# EAGLE design RCS_Cntrl_Board (EAGLE 8.7.1)
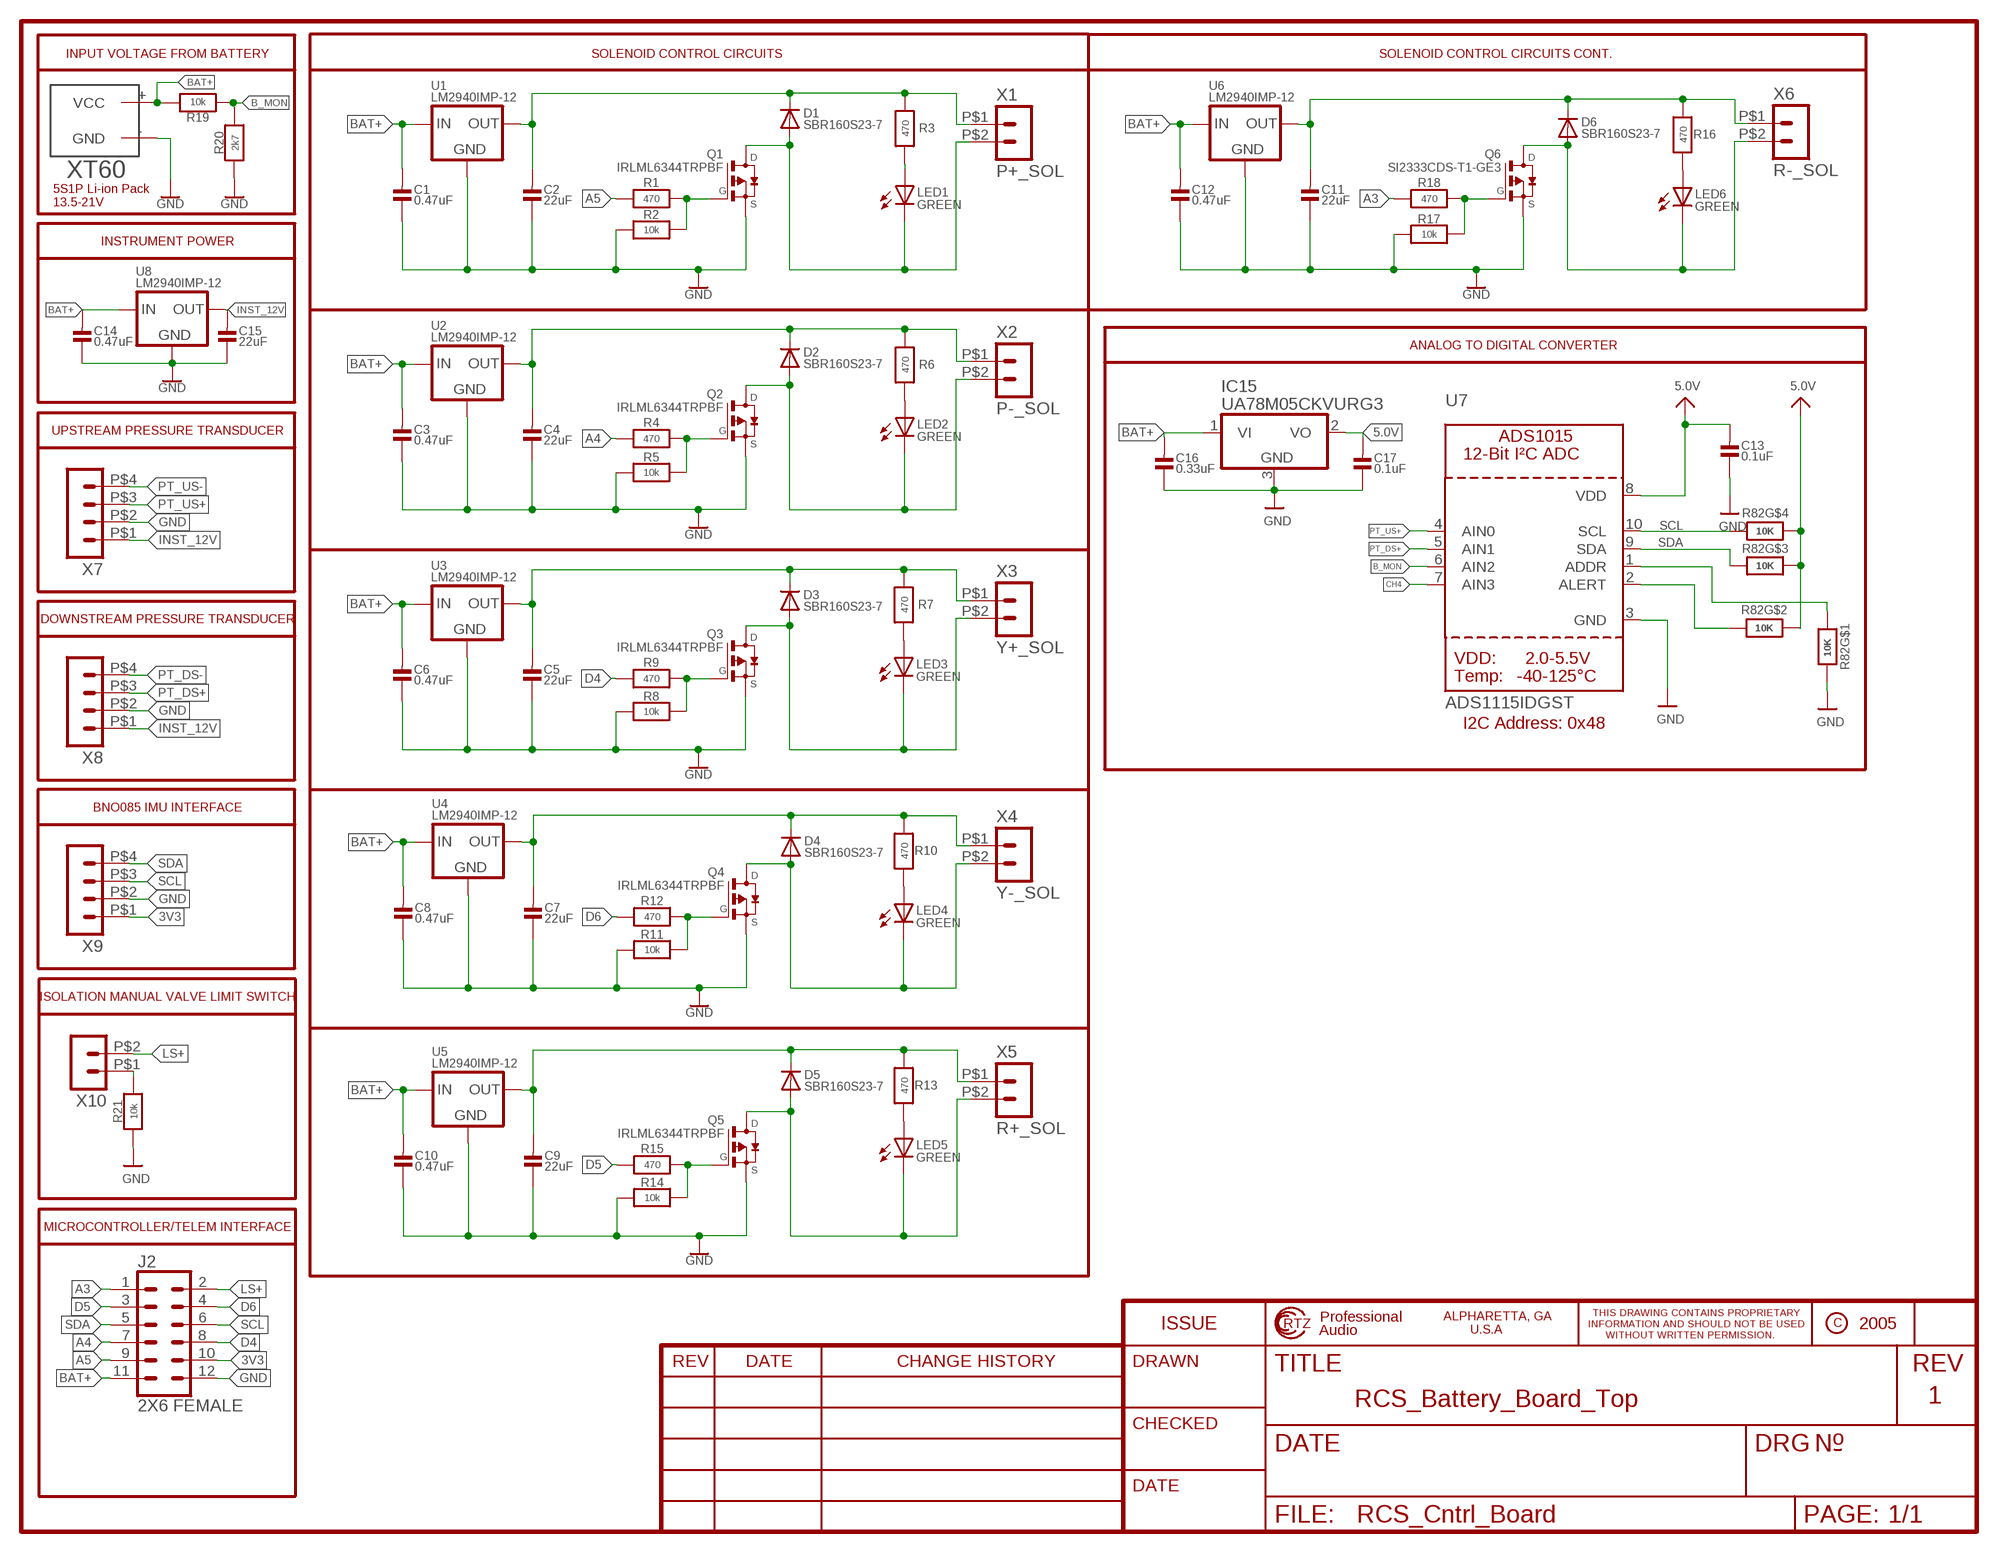
[diagram p0: schematic, sheet 1]

## Parts
C1  0.47uF  CAP_CERAMIC0603  [0603]
C2  22uF  CAP_CERAMIC0603  [0603]
C3  0.47uF  CAP_CERAMIC0603  [0603]
C4  22uF  CAP_CERAMIC0603  [0603]
C5  22uF  CAP_CERAMIC0603  [0603]
C6  0.47uF  CAP_CERAMIC0603  [0603]
C7  22uF  CAP_CERAMIC0603  [0603]
C8  0.47uF  CAP_CERAMIC0603  [0603]
C9  22uF  CAP_CERAMIC0603  [0603]
C10  0.47uF  CAP_CERAMIC0603  [0603]
C11  22uF  CAP_CERAMIC0603  [0603]
C12  0.47uF  CAP_CERAMIC0603  [0603]
C13  0.1uF  CAP_CERAMIC0603  [0603]
C14  0.47uF  CAP_CERAMIC0603  [0603]
C15  22uF  CAP_CERAMIC0603  [0603]
C16  0.33uF  CAP_CERAMIC0603  [0603]
C17  0.1uF  CAP_CERAMIC0603  [0603]
D1  SBR160S23-7  DIODESOT23_REFLOW  [SOT23-R]
D2  SBR160S23-7  DIODESOT23_REFLOW  [SOT23-R]
D3  SBR160S23-7  DIODESOT23_REFLOW  [SOT23-R]
D4  SBR160S23-7  DIODESOT23_REFLOW  [SOT23-R]
D5  SBR160S23-7  DIODESOT23_REFLOW  [SOT23-R]
D6  SBR160S23-7  DIODESOT23_REFLOW  [SOT23-R]
IC15  UA78M05CKVURG3  7806DT  [TO252]
J2  2X6 FEMALE  CONN_06X2PTH_FEMALE  [2X6]
LED1  GREEN  LEDCHIPLED_0603  [CHIPLED_0603]
LED2  GREEN  LEDCHIPLED_0603  [CHIPLED_0603]
LED3  GREEN  LEDCHIPLED_0603  [CHIPLED_0603]
LED4  GREEN  LEDCHIPLED_0603  [CHIPLED_0603]
LED5  GREEN  LEDCHIPLED_0603  [CHIPLED_0603]
LED6  GREEN  LEDCHIPLED_0603  [CHIPLED_0603]
Q1  IRLML6344TRPBF  TRANSISTOR-FET_DMP2004K  [TRANSISTOR-FET_SOT23]
Q2  IRLML6344TRPBF  TRANSISTOR-FET_DMP2004K  [TRANSISTOR-FET_SOT23]
Q3  IRLML6344TRPBF  TRANSISTOR-FET_DMP2004K  [TRANSISTOR-FET_SOT23]
Q4  IRLML6344TRPBF  TRANSISTOR-FET_DMP2004K  [TRANSISTOR-FET_SOT23]
Q5  IRLML6344TRPBF  TRANSISTOR-FET_DMP2004K  [TRANSISTOR-FET_SOT23]
Q6  SI2333CDS-T1-GE3  TRANSISTOR-FET_DMP2004K  [TRANSISTOR-FET_SOT23]
R1  470  RESISTOR_0603_NOOUT  [0603-NO]
R2  10k  RESISTOR_0603_NOOUT  [0603-NO]
R3  470  RESISTOR_0603_NOOUT  [0603-NO]
R4  470  RESISTOR_0603_NOOUT  [0603-NO]
R5  10k  RESISTOR_0603_NOOUT  [0603-NO]
R6  470  RESISTOR_0603_NOOUT  [0603-NO]
R7  470  RESISTOR_0603_NOOUT  [0603-NO]
R8  10k  RESISTOR_0603_NOOUT  [0603-NO]
R9  470  RESISTOR_0603_NOOUT  [0603-NO]
R10  470  RESISTOR_0603_NOOUT  [0603-NO]
R11  10k  RESISTOR_0603_NOOUT  [0603-NO]
R12  470  RESISTOR_0603_NOOUT  [0603-NO]
R13  470  RESISTOR_0603_NOOUT  [0603-NO]
R14  10k  RESISTOR_0603_NOOUT  [0603-NO]
R15  470  RESISTOR_0603_NOOUT  [0603-NO]
R16  470  RESISTOR_0603_NOOUT  [0603-NO]
R17  10k  RESISTOR_0603_NOOUT  [0603-NO]
R18  470  RESISTOR_0603_NOOUT  [0603-NO]
R19  10k  RESISTOR_0603_NOOUT  [0603-NO]
R20  2k7  RESISTOR_0603_NOOUT  [0603-NO]
R21  10k  RESISTOR_0603_NOOUT  [0603-NO]
R82  10K  RESISTOR_4PACK  [RESPACK_4X0603]
U1  LM2940IMP-12  LM2940IMP-12/NOPB  [SOT223-R]
U2  LM2940IMP-12  LM2940IMP-12/NOPB  [SOT223-R]
U3  LM2940IMP-12  LM2940IMP-12/NOPB  [SOT223-R]
U4  LM2940IMP-12  LM2940IMP-12/NOPB  [SOT223-R]
U5  LM2940IMP-12  LM2940IMP-12/NOPB  [SOT223-R]
U6  LM2940IMP-12  LM2940IMP-12/NOPB  [SOT223-R]
U7  ADS1115IDGST  ADC_ADS1015  [MSOP10]
U8  LM2940IMP-12  LM2940IMP-12/NOPB  [SOT223-R]
U$4  XT60  [XT60]
X1  P+_SOL  HEADER_POS2_44914-0201  [44914-0201]
X2  P-_SOL  HEADER_POS2_44914-0201  [44914-0201]
X3  Y+_SOL  HEADER_POS2_44914-0201  [44914-0201]
X4  Y-_SOL  HEADER_POS2_44914-0201  [44914-0201]
X5  R+_SOL  HEADER_POS2_44914-0201  [44914-0201]
X6  R-_SOL  HEADER_POS2_44914-0201  [44914-0201]
X7  HEADER_POS4_43650-0415  [43650-0415]
X8  HEADER_POS4_43650-0415  [43650-0415]
X9  HEADER_POS4_43650-0415  [43650-0415]
X10  HEADER_POS2_43650-0215  [43650-0215]

## Nets
3V3: J2.10 X9.P$1
5.0V [N$1]: C13.2 C17.2 IC15.2(VO) R82.5 R82.6 R82.7 U7.8(VDD)
A3: J2.1 R18.1
A4: J2.7 R4.1
A5: J2.9 R1.1
B_MON: R19.1 R20.2 U7.6(AIN2)
BAT+: C1.2 C3.2 C6.2 C8.2 C10.2 C12.2 C14.2 C16.2 IC15.1(VI) J2.11 R19.2 U1.1(IN) U2.1(IN) U3.1(IN) U4.1(IN) U5.1(IN) U6.1(IN) U8.1(IN) U$4.+(VCC)
CH4: U7.7(AIN3)
D4: J2.8 R9.1
D5: J2.3 R15.1
D6: J2.4 R12.1
GND [T1_OUT]: C1.1 C2.1 C3.1 C4.1 C5.1 C6.1 C7.1 C8.1 C9.1 C10.1 C11.1 C12.1 C13.1 C14.1 C15.1 C16.1 C17.1 IC15.3(GND) J2.12 Q1.2(S) Q2.2(S) Q3.2(S) Q4.2(S) Q5.2(S) Q6.2(S) R2.1 R5.1 R8.1 R11.1 R14.1 R17.1 R20.1 R21.1 R82.8 U1.2(GND) U2.2(GND) U3.2(GND) U4.2(GND) U5.2(GND) U6.2(GND) U7.3(GND) U8.2(GND) U$4.-(GND) X7.P$2 X8.P$2 X9.P$2
INST_12V: C15.2 U8.3(OUT) X7.P$1 X8.P$1
LS+: J2.2 X10.P$2
N$1: LED1.A R3.1
N$2: C2.2 D1.3(C) R3.2 U1.3(OUT) X1.P$1
N$3 [T1_OUT]: D2.1(A) LED2.C Q2.3(D) X2.P$2
N$4: LED2.A R6.1
N$5: Q2.1(G) R4.2 R5.2
N$6 [T1_OUT]: D3.1(A) LED3.C Q3.3(D) X3.P$2
N$7: Q3.1(G) R8.2 R9.2
N$8: C4.2 D2.3(C) R6.2 U2.3(OUT) X2.P$1
N$9: LED3.A R7.1
N$10 [T1_OUT]: D4.1(A) LED4.C Q4.3(D) X4.P$2
N$11 [T1_OUT]: D5.1(A) LED5.C Q5.3(D) X5.P$2
N$12: C5.2 D3.3(C) R7.2 U3.3(OUT) X3.P$1
N$13: LED4.A R10.1
N$14: Q4.1(G) R11.2 R12.2
N$15: C7.2 D4.3(C) R10.2 U4.3(OUT) X4.P$1
N$16: Q5.1(G) R14.2 R15.2
N$17: LED5.A R13.1
N$18 [T1_OUT]: D6.1(A) LED6.C Q6.3(D) X6.P$2
N$19: Q6.1(G) R17.2 R18.2
N$20: C9.2 D5.3(C) R13.2 U5.3(OUT) X5.P$1
N$21: LED6.A R16.1
N$24: C11.2 D6.3(C) R16.2 U6.3(OUT) X6.P$1
N$25: R21.2 X10.P$1
N$26 [T1_OUT]: D1.1(A) LED1.C Q1.3(D) X1.P$2
N$28: Q1.1(G) R1.2 R2.2
N$38: R82.2 U7.2(ALERT)
N$41: R82.1 U7.1(ADDR)
PT_DS+: U7.5(AIN1) X8.P$3
PT_DS-: X8.P$4
PT_US+: U7.4(AIN0) X7.P$3
PT_US-: X7.P$4
SCL: J2.6 R82.4 U7.10(SCL) X9.P$3
SDA: J2.5 R82.3 U7.9(SDA) X9.P$4

## Notes on the sheet
- INPUT VOLTAGE FROM BATTERY | SOLENOID CONTROL CIRCUITS | SOLENOID CONTROL CIRCUITS CONT.
- 5S1P Li-ion Pack
- 13.5-21V
- INSTRUMENT POWER
- ANALOG TO DIGITAL CONVERTER
- UPSTREAM PRESSURE TRANSDUCER
- DOWNSTREAM PRESSURE TRANSDUCER
- I2C Address: 0x48
- BNO085 IMU INTERFACE
- ISOLATION MANUAL VALVE LIMIT SWITCH
- MICROCONTROLLER/TELEM INTERFACE
- RCS_Battery_Board_Top | 1

## Library data of the parts
C1-C17 = microbuilder:CAP_CERAMIC: Ceramic Capacitors 0402 - 0402 Surface Mount Capacitors 16pF 50V 5% [Digikey: 445-4899-2-ND] 18pF 50V 5% [Digikey: 490-1281-2-ND] 22pF 50V 5% [Digikey: 490-1283-2-ND] 68pF 50V 5% [Digikey: 490-1289-2-ND] 0.1uF 10V 10% [Digikey: 490-1318-2-ND] 1.0uF 6.3V 10% [Digikey: 490-1320-2-ND] 0603 - 0603 Surface Mount Capacitors 16 pF 50V 5% [Digikey: 445-5051-2-ND] 22 pF 50V [Digikey: PCC220ACVTR-ND] 33 pF 50V 5% [Digikey: 490-1415-1-ND] 56pF 50V 5% [Digikey: 490-1421-1-ND] 220pF 50V 5% [Digikey: 445-1285-1-ND] 680 pF 50V 2200 pF 50V 5% C0G [Digikey: 445-1297-1-ND] 5600 pF 100V 5% X7R [Digikey: 478-3711-1-ND] 0.1 µF 25V 10% [Digikey: PCC2277TR-ND] 0.22 µF 16V 10% X7R [Digikey: 445-1318-1-ND] 1.0 µF 25V 10% [Digikey: 445-5146-2-ND] 0603 - RF Specific 3pF 250V +/-0.1pF RF [Digikey: 712-1347-1-ND] 18 pF 250V 5% [Digikey: 478-3505-1-ND or 712-1322-1-ND] 56 pF 250V 5% C0G RF [Digikey: 490-4867-1-ND] 68 pF 250V RF [Digikey: 490-4868-1-ND] 0805 - 0805 Surface Mount Capacitors 220 pF 250V 2% RF Ceramic Capacitor [Digikey: 712-1398-1-ND] 1000 pF 50V 2% NP0 Ceramic Capacitor [Digikey: 478-3760-1-ND] 0.1 µF 25V 10% Ceramic Capacitor [Digikey: PCC1828TR-ND] 1.0 µF 16V 10% Ceramic Capacitor[Digikey: 490-1691-2-ND] 10.0 µF 10V 10% Ceramic Capacitor[Digikey: 709-1228-1-ND] 10.0 uF 16V 10% Ceramic Capacitor [Digikey: 478-5165-2-ND] 47 uF 6.3V 20% Ceramic Capacitor [Digikey: 587-1779-1-ND or 399-5506-1-ND] 1206 - 1206 Surface Mount Capacitors 47uF 10V 20% Ceramic Capacitor [Digikey: 490-5528-1-ND or 399-5508-1-ND or 445-6010-1-ND]
D1-D6 = adafruit:DIODE: Diode SMADIODE - SMA Surface Mount Package 20V 1A Schottky Diode Digikey: 641-1014-6-ND DO-1N4148 - Through Hole Small Current Diode SOD-123 20V 1 A (.5mV Vf) Schottky Diode - Digikey: MBRX120TPMSCT-ND SOD-323 10V 570mA (.38mV Vf, 3ns) Schottky Diode - Digikey: ZLLS410CT-ND SOD-523 30V 30mA Schottky Diode (RB751S-40TE61) - Digikey: RB751S-40TE61CT-ND SOT23-R/W - SOT23 Package (R = Solder Paste/Reflow Ovens, W = Hand-Soldering) BAT54Film 40V 300mA - Digikey: 497-7162-1-ND
IC15 = adafruit:78*: Positive VOLTAGE REGULATOR Added bigger pads to the TO-92 package
J2 = SparkFun-Connectors:CONN_06X2: Multi connection point. Often used as Generic Header-pin footprint for 0.1 inch spaced/style header connections On any of the 0.1 inch spaced packages, you can populate with these: Break Away Headers - Straight <https://www.sparkfun.com/products/116> (PRT-00116) Break Away Male Headers - Right Angle <https://www.sparkfun.com/products/553> (PRT-00553) Female Headers <https://www.sparkfun.com/products/115> (PRT-00115) Break Away Headers - Machine Pin <https://www.sparkfun.com/products/117> (PRT-00117) Break Away Female Headers - Swiss Machine Pin <https://www.sparkfun.com/products/743> (PRT-00743); PROD_ID: CONN-12423
LED1-LED6 = adafruit:LED: LED OSRAM: - CHIPLED LG R971, LG N971, LY N971, LG Q971, LY Q971, LO R971, LY R971 LH N974, LH R974 LS Q976, LO Q976, LY Q976 LO Q996 - Hyper CHIPLED LW Q18S LB Q993, LB Q99A, LB R99A - SideLED LS A670, LO A670, LY A670, LG A670, LP A670 LB A673, LV A673, LT A673, LW A673 LH A674 LY A675 LS A676, LA A676, LO A676, LY A676, LW A676 LS A679, LY A679, LG A679 - Hyper Micro SIDELED® LS Y876, LA Y876, LO Y876, LY Y876 LT Y87S - SmartLED LW L88C, LW L88S LB L89C, LB L89S, LG L890 LS L89K, LO L89K, LY L89K LS L896, LA L896, LO L896, LY L896 - TOPLED LS T670, LO T670, LY T670, LG T670, LP T670 LSG T670, LSP T670, LSY T670, LOP T670, LYG T670 LG T671, LOG T671, LSG T671 LB T673, LV T673, LT T673, LW T673 LH T674 LS T676, LA T676, LO T676, LY T676, LB T676, LH T676, LSB T676, LW T676 LB T67C, LV T67C, LT T67C, LS T67K, LO T67K, LY T67K, LW E67C LS E67B, LA E67B, LO E67B, LY E67B, LB E67C, LV E67C, LT E67C LW T67C LS T679, LY T679, LG T679 LS T770, LO T770, LY T770, LG T770, LP T770 LB T773, LV T773, LT T773, LW T773 LH T774 LS E675, LA E675, LY E675, LS T675 LS T776, LA T776, LO T776, LY T776, LB T776 LHGB T686 LT T68C, LB T68C - Hyper Mini TOPLED® LB M676 - Mini TOPLED Santana® LG M470 LS M47K, LO M47K, LY M47K Source: http://www.osram.convergy.de/
Q1-Q6 = 52101-101-REV-A:TRANSISTOR-FET_DMP2004K: P-Channel Enhancement MOSFET
R1-R21 = microbuilder:RESISTOR: Resistors For new designs, use the packages preceded by an '_' character since they are more reliable: The following footprints should be used on most boards: _0402 - Standard footprint for regular board layouts _0603 - Standard footprint for regular board layouts _0805 - Standard footprint for regular board layouts _1206 - Standard footprint for regular board layouts For extremely tight-pitch boards where space is at a premium, the following 'micro-pitch' footprints can be used (smaller pads, no silkscreen outline, etc.): _0402MP - Micro-pitch footprint for very dense/compact boards _0603MP - Micro-pitch footprint for very dense/compact boards _0805MP - Micro-pitch footprint for very dense/compact boards _1206MP - Micro-pitch footprint for very dense/compact boards
R82 = microbuilder:RESISTOR_4PACK: Resistor Packs (4 resistors) 4 x 0603 10K 1/16W - Digikey: YC164J-10KCT-ND
U1-U6 U8 = Shawn'sCustomComponents:LM2940IMP-12/NOPB
U7 = microbuilder:ADC_ADS1015: ADS1015 - 12-bit 4-Channel I2C ADC with Internal PGA VDD: 2.0-5.5V Sampling Rate: 3.3ksps Gain Settings: 2/3, 1, 2, 4, 8, 16 I2C Address: ADDR low = 1001000x, ADDR high = 1001001x Internal Comparator The ADS1015 includes an internal comparator that can be set to output a high-level on ALERT when the conversion results exceeeds a pre-defined upper level, and will deassert itself when the level falls below a pre-defined lower threshold level. It can also be set to windowed mode where the ALERT pin will be asserted if the data exceeds the upper threshold or falls below the lower threshold.
U$4 = XT60:XT60: XT60
X1-X6 X10 = con-molex-micro-fit-3_0:HEADER_POS2_?: Molex - Micro-Fit 3.0 Series connector, 3.00mm (0.118") pitch header, 2 positions.
X7-X9 = con-molex-micro-fit-3_0:HEADER_POS4_?: Molex - Micro-Fit 3.0 Series connector, 3.00mm (0.118") pitch header, 4 positions.

## Board
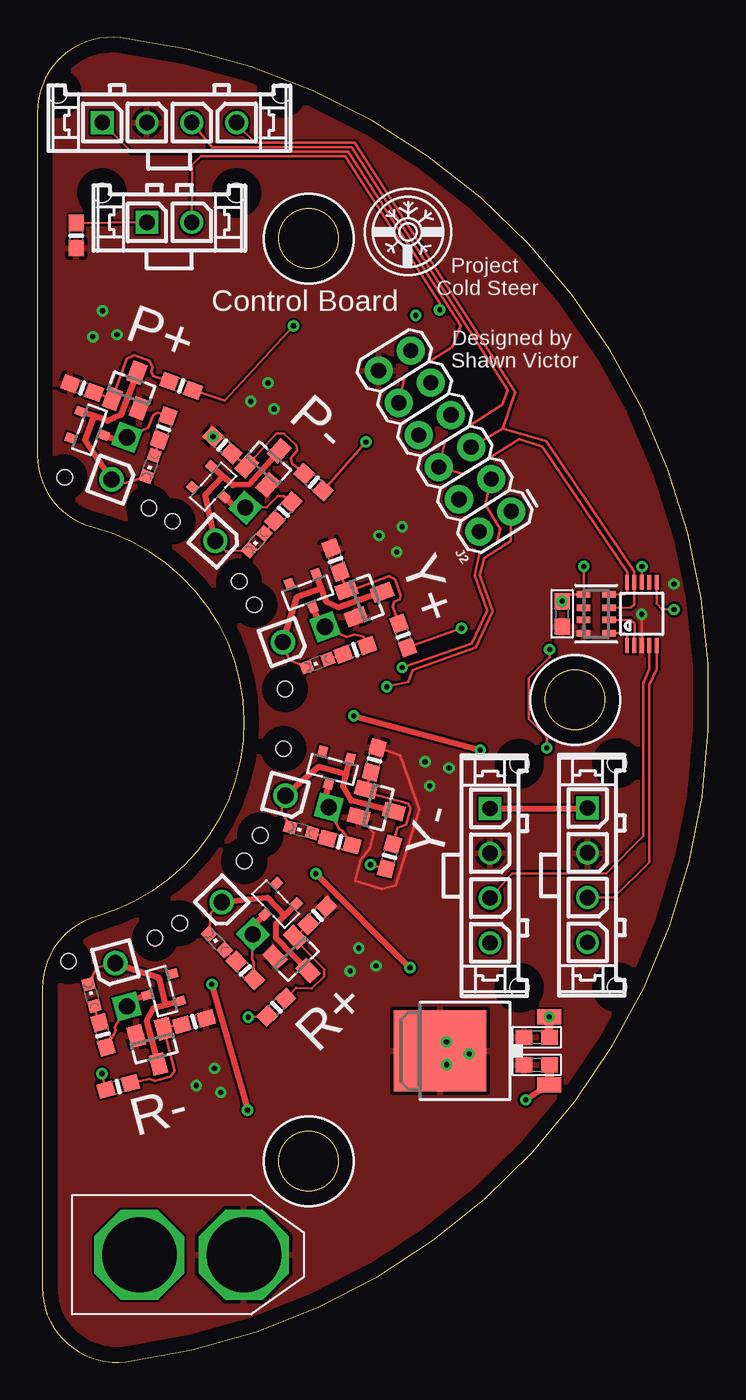
[diagram p1: board, top side]
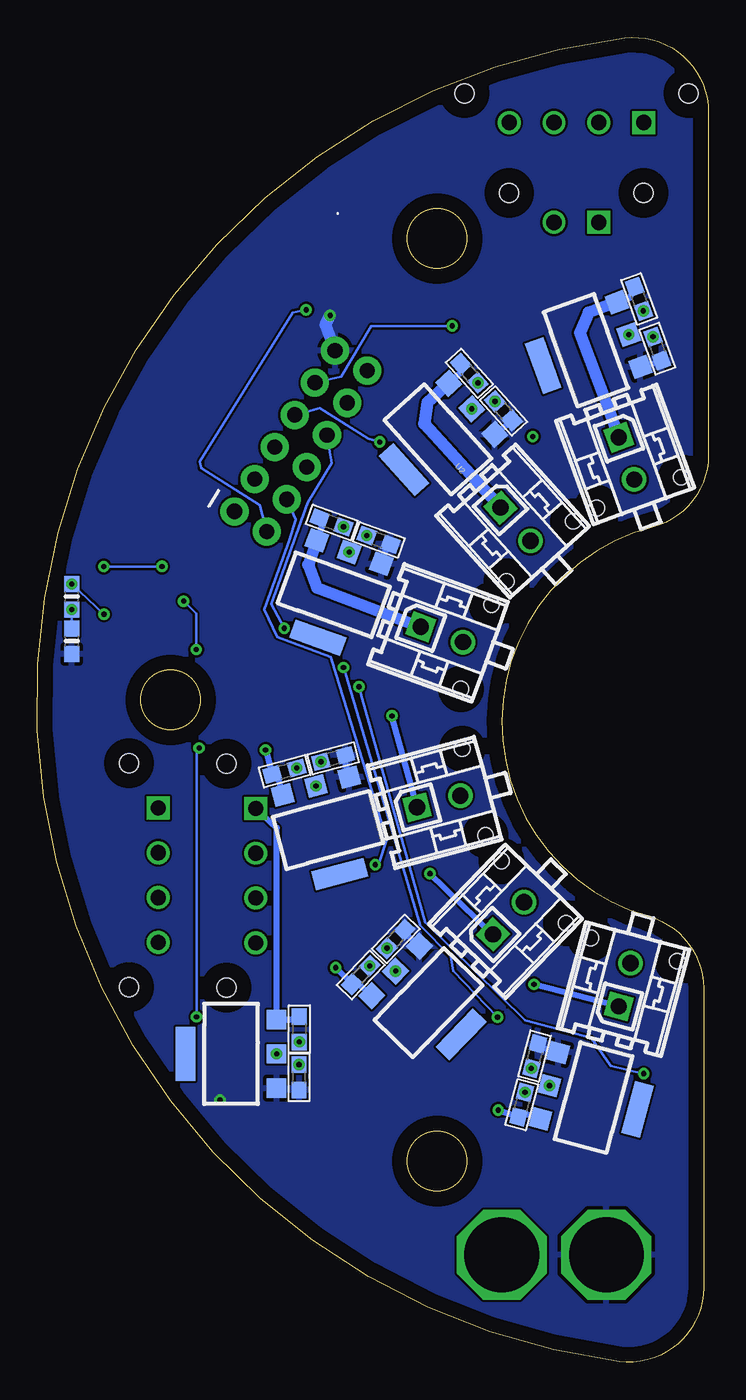
[diagram p2: board, bottom side, seen from below]

Size 44.92 x 88.71 mm. Coordinates in mm from the lower left corner, seen from the top.
Outline: 3.98,29.85 arc74 0.33,25.03 0.33,5 arc97 5.96,0.04 arc166 5.59,88.67 arc97 0,83.71 0,60.74 arc75 3.74,55.91 arc-150 3.98,29.85
Outline: circle at 35.99,44.34 radius 2
Outline: circle at 18.16,75.23 radius 2
Outline: circle at 18.16,13.46 radius 2
Copper layers (1*16): Top 0.035mm / dielectric 1.5mm / Bottom 0.035mm
Design rules "default": minimum track width 6mil, minimum drill 0.35mm, track to track 6mil, track to pad 6mil, pad to pad 6mil, via to via 6mil, smd to smd 6mil, copper to edge 40mil, drill to drill 6mil, minimum pad ring 10mil, minimum via ring 8mil, stop-mask expansion 4mil, vias tented up to drill 0mil, thermal gap 10mil

### Footprints (pad centres in the part's own frame; a part is rotated, then mirrored left to right if it is on the bottom)
0603 = smd 1.1 x 1: 1 -0.85,0; 2 0.85,0
SOT23-R = smd 0.6 x 0.7: 1 -0.95,-1; 2 0.95,-1; 3 0,1
TO252 = smd 1 x 1.6: 1 -2.28,-4.8; 2 2.28,-4.8 | smd 5.4 x 6.2: 3 0,2.5
2X6 = drill 1.016 pad 1.88: 1 0,0; 2 0,2.54; 3 2.54,0; 4 2.54,2.54; 5 5.08,0; 6 5.08,2.54; 7 7.62,0; 8 7.62,2.54; 9 10.16,0; 10 10.16,2.54; 11 12.7,0; 12 12.7,2.54
CHIPLED_0603 = smd 0.8 x 0.8: A 0,-0.75; C 0,0.75
TRANSISTOR-FET_SOT23 = smd 1 x 1.4: 1 -0.95,-1.1; 2 0.95,-1.1; 3 0,1.1
0603-NO = smd 1.075 x 1: 1 -0.85,0; 2 0.85,0
RESPACK_4X0603 = smd 0.45 x 0.9: 1 -1.3,-0.85; 2 -0.4,-0.85; 3 0.4,-0.85; 4 1.3,-0.85; 5 1.3,0.85; 6 0.4,0.85; 7 -0.4,0.85; 8 -1.3,0.85
SOT223-R = smd 1.3 x 1.3: 1 -2.3,-3.05; 2 0,-3.05; 3 2.3,-3.05 | smd 3.6 x 1.3: 4 0,3.05
MSOP10 = smd 0.25 x 1: 1 -1,-2.113; 2 -0.5,-2.113; 3 0,-2.113; 4 0.5,-2.113; 5 1,-2.113; 6 1,2.113; 7 0.5,2.113; 8 0,2.113; 9 -0.5,2.113; 10 -1,2.113
XT60 = drill 5 octagon: + 4.5,0; - 11.5,0
44914-0201 = drill 1.09 square: P$1 0,0 | drill 1.09: P$2 0,3 | hole 1.02: 3,3.94; -3,3.94
43650-0415 = drill 1.02 square: P$1 4.5,0 | drill 1.02: P$2 1.5,0; P$3 -1.5,0; P$4 -4.5,0 | hole 1.27: 7.5,-1.96; -7.5,-1.96
43650-0215 = drill 1.02 square: P$1 1.5,0 | drill 1.02: P$2 -1.5,0 | hole 1.27: 4.5,-1.96; -4.5,-1.96

### Placement (x,y rotation side)
C1  3.43,67.86 290 bottom
C2  4.65,71.19 110 bottom
C3  13.71,63.69 312 bottom
C4  16,66.21 132 bottom
C5  25.22,56.23 160 bottom
C6  22.07,55.06 340 bottom
C7  28.37,39.56 195 bottom
C8  25.12,40.43 15 bottom
C9  23.26,25.92 226 bottom
C10  20.93,28.34 46 bottom
C11  12.49,17.24 255 bottom
C12  11.63,20.49 75 bottom
C13  35.13,50.11 90 top
C14  27.4,19.07 270 bottom
C15  27.38,22.29 90 bottom
C16  33.42,19.9 0 top
C17  33.42,21.76 0 top
D1  3.5,62.42 250 top
D2  11.76,58.61 228 top
D3  18.11,51.5 200 top
D4  19.76,39.69 165 top
D5  15.95,30.67 134 top
D6  8.33,24.83 105 top
IC15  29.46,20.84 90 top
J2  31.72,56.96 122 top
LED1  7.57,60.01 160 top
LED2  14.68,54.93 138 top
LED3  18.74,46.8 110 top
LED4  17.65,35.63 75 top
LED5  12.01,28.13 44 top
LED6  3.63,24.58 15 top
Q1  6.3,65.22 340 top
Q2  15.47,60.19 318 top
Q3  22.04,51.17 290 top
Q4  22.81,37.15 255 top
Q5  17.35,26.99 224 top
Q6  7.82,21.02 195 top
R1  9.62,65.37 160 top
R2  2.99,65.22 340 top
R3  8.46,62.55 70 top
R4  18.49,58.92 138 top
R5  12.39,61.41 318 top
R6  16.46,56.96 48 top
R7  21.28,47.69 20 top
R8  19.96,53.71 290 top
R9  24.48,48.66 110 top
R10  20.24,34.84 345 top
R11  22.55,40.33 255 top
R12  23.57,33.85 75 top
R13  13.92,26.23 314 top
R14  18.74,29.91 224 top
R15  16,23.77 44 top
R16  4.39,21.91 285 top
R17  10.49,22.8 195 top
R18  5.41,18.46 15 top
R19  42.62,48.28 270 bottom
R20  42.62,51.25 270 bottom
R21  2.61,75.43 90 top
R82  37.41,50.11 90 top
U1  8.2,67.76 110 bottom
U2  18.11,61.79 132 bottom
U3  25.09,51.38 160 bottom
U4  25.47,35.63 195 bottom
U5  18.74,24.07 226 bottom
U6  7.69,17.72 255 bottom
U7  40.46,50.11 0 top
U8  31.95,20.64 90 bottom
U$4  2.33,7.19 0 top
X1  6,61.92 200 bottom
X2  13.92,57.22 222 bottom
X3  19.25,49.24 250 bottom
X4  19.5,37.15 285 bottom
X5  14.42,28.64 316 bottom
X6  6,23.82 345 bottom
X7  30.3,32.58 90 top
X8  36.83,32.6 90 top
X9  8.84,83 180 top
X10  8.84,76.32 180 top

### Tracks (layer width: path | path; a pad name or v marks a point on that pad's centre or on a via)
3V3
  Top 0.152: X9.P$1 6.27,81.04 20.83,81.04 28.34,69.41 27.76,67.96 24.58,65.98 J2.10
5.0V  (via drill 0.35)
  Top 0.152: R82.7 R82.6 R82.5 | R82.5 35.56,51.4 C13.2 | U7.8 v40.47,53.27 | v36.57,53.28 R82.5 | v34.09,41.12 34.09,41.87 32.9,43.06 32.9,45.82 34.29,47.21 v34.29,47.72
  Top 0.61: C17.2 IC15.2
  Bottom 0.152: v40.47,53.27 v36.57,53.28 | IC15.2 34.26,40.95 v34.09,41.12 | v34.29,47.72 34.29,50.12 C13.2
  other vias: 34.26,23.12 35.13,50.96
A3  (via drill 0.35)
  Top 0.152: J2.1 31.67,54.98 29.92,53.84 29.61,52.7 30.48,50.31 29.36,47.84 25.12,46.35 24.84,45.53 v23.39,45.23 | v4.33,19.31 R18.1
  Bottom 0.152: v23.39,45.23 18.95,29.46 12.27,22.88 7.85,21.71 6.55,19.85 v4.33,19.31
A4  (via drill 0.35)
  Top 0.152: R4.1 v21.99,61.61
  Bottom 0.152: J2.7 26.01,63.87 22.78,61.84 v21.99,61.61
A5  (via drill 0.35)
  Top 0.152: R1.1 12.53,64.37 v17.14,69.38
  Bottom 0.152: v17.14,69.38 22.55,69.38 24.58,65.98 J2.9
B_MON  (via drill 0.35)
  Top 0.152: U7.6 41.45,50.79 41.81,50.41 R20.2
  Bottom 0.152: R19.1 R20.2
  other vias: 42.62,50.4
BAT+  (via drill 0.35)
  Top 0.406: IC15.1 v32.69,17.57
  Top 0.61: C16.2 IC15.1
  Bottom 0.406: C1.2 4.04,66.72 U1.1 | U2.1 C3.2 | U3.1 21.59,54.37 C6.2 | U4.1 24.28,40.12 C8.2 | U5.1 20.06,28.52 C10.2 | U6.1 11,21.02 C12.2
  Bottom 0.813: J2.11 25.63,69.46 v25.32,70.1
  pour Bottom: -2.21,-1.71 51.13,-1.71 51.13,92.27 -2.21,92.27
D4  (via drill 0.35)
  Top 0.152: R9.1 v28.39,49.14
  Bottom 0.152: v28.39,49.14 29.26,50.77 26.82,57.55 25.22,60.21 J2.8
D5  (via drill 0.35)
  Top 0.152: v24.42,46.52 29.08,48.12 30.12,50.33 29.28,52.67 29.59,54.14 30.75,54.87 30.97,55.8 29.99,57.42 J2.3 | v14.12,23.11 R15.1
  Bottom 0.152: v24.42,46.52 19.3,29.23 17.24,27.17 17.09,26.2 v14.12,23.11
D6  (via drill 0.35)
  Top 0.152: v22.3,33.32 R12.1
  Bottom 0.152: J2.4 27.63,56.43 28.06,55.01 29.74,50.38 28.85,48.55 25.27,47.21 21.54,34.99 22.07,33.37 v22.3,33.32
GND  (via drill 0.35)
  Top 0.152: U7.3 v40.46,50.08 | R11.1 24.28,40.63 25.58,37 24,31.92 23.06,31.69 21.28,32.22 21.61,33.6 22.25,34.38 22.5,35.42 Q4.2
  Top 0.406: IC15.3 C14.1
  Bottom 0.152: v40.46,50.08 R20.1
  other vias: 42.62,52.1 3.72,68.66 4.35,70.39 14.28,64.33 15.43,65.58 5.34,68.8 15.84,63.83 22.87,55.35 24.42,55.94 24.05,54.24 25.94,40.21 27.55,39.78 26.26,38.57 21.52,27.73 22.67,26.54 20.94,26.19 11.85,19.67 12.27,18.06 10.64,18.51 28.9,20.64 27.4,19.92 27.38,21.44 11.76,61.98
  pour Top: -0.94,-0.44 49.86,-0.44 49.86,91 -0.94,91
INST_12V
  Top 0.406: X7.P$1 36.8,37.08 X8.P$1
  Bottom 0.406: C15.2 27.89,22.95 U8.3 28.88,35.78 X7.P$1
LS+  (via drill 0.35)
  Top 0.152: X10.P$2 10.36,79.21 10.36,80.18 10.94,80.74 20.6,80.74 26.95,70.91 v26.93,70.46
  Bottom 0.152: v26.93,70.46 27.81,70.27 34.03,60.29 33.96,59.86 30.02,57.4 J2.2
N$1
  Top 0.152: LED1.A 8.02,61.26 R3.1
N$2
  Top 0.152: X1.P$1 7.44,62.58 7.74,63.42 8.07,63.57 R3.2
  Top 0.406: D1.3 5.2,61.81 X1.P$1
  Bottom 0.406: U1.3 5.26,71.26 C2.2
  Bottom 0.813: U1.3 8.02,70.27 8.61,68.9 6.71,63.83 X1.P$1
N$3
  Top 0.152: LED2.C 12.65,54.27 X2.P$2
  Top 0.406: Q2.3 14.17,58.77 13.1,58.72 12.4,59.34 | 12.4,59.34 D2.1 | X2.P$2 11.25,58.08 12.4,59.34
N$4
  Top 0.152: LED2.A 15.57,55.92 R6.1
N$5
  Top 0.152: R5.2 Q2.1 15.97,62.17 16.48,62.17 17.32,61.41 17.4,61.03 16.96,60.52 17.07,60.16 R4.2
N$6
  Top 0.152: LED3.C 16.86,47.01 X3.P$2
  Top 0.406: Q3.3 20.16,50.54 19.38,50.89 19.01,51.84 | 19.01,51.84 D3.1 | X3.P$2 17.4,51.25 19.01,51.84
N$7
  Top 0.152: R8.2 Q3.1 21.26,51.76 23.57,52.62 23.95,52.42 24.33,51.32 24.25,51.07 23.9,50.92 23.8,50.59 R9.2
N$8
  Top 0.152: X2.P$1 15.36,57.27 16.08,57.98 16.51,58 R6.2
  Top 0.406: D2.3 13.08,57.4 X2.P$1
  Bottom 0.406: U2.3 16.56,66.29 C4.2
  Bottom 0.813: U2.3 18.82,64.25 19.02,62.83 X2.P$1
N$9
  Top 0.152: LED3.A R7.1
N$10
  Top 0.152: LED4.C 16.33,36.9 X4.P$2
  Top 0.406: Q4.3 21,37.61 20.47,38.55 20.68,39.38 | 20.68,39.38 D4.1 | X4.P$2 18.82,39.87 20.68,39.38
N$11
  Top 0.152: LED5.C 11.61,30.06 X5.P$2
  Top 0.406: Q5.3 15.97,28.39 15.97,29.33 16.57,29.93 | 16.57,29.93 D5.1 | X5.P$2 15.42,31.11 16.57,29.93
N$12
  Top 0.152: X3.P$1 20.72,48.56 21.26,48.73 21.82,48.58 R7.2
  Top 0.406: D3.3 18.77,49.7 X3.P$1
  Bottom 0.406: U3.3 25.85,55.95 C5.2
  Bottom 0.813: U3.3 26.79,53.38 26.21,51.86 X3.P$1
N$13
  Top 0.152: LED4.A 18.95,35.27 R10.1
N$14
  Top 0.152: R12.2 24.05,35.6 24.13,35.81 24.36,35.88 24.69,36.01 24.99,37.08 24.84,37.41 22.43,38.04 Q4.1 R11.2
N$15  (via drill 0.35)
  Top 0.152: R10.2 20.42,35.6 20.22,35.65 X4.P$1
  Top 0.406: D4.3 19.3,37.94 X4.P$1 | v21.18,43.27 v29.64,40.99
  Bottom 0.406: U4.3 28.78,39.06 C7.2 v29.64,40.99 | X4.P$1 v21.18,43.27
N$16
  Top 0.152: Q5.1 17.32,28.49 | 17.32,28.49 R14.2 | 17.32,28.49 17.55,27.98 19.2,26.31 19.2,25.82 18.36,25.01 17.32,25.06 R15.2
N$17
  Top 0.152: LED5.A R13.1
N$18
  Top 0.152: LED6.C 3.96,26.43 X6.P$2
  Top 0.406: Q6.3 7.34,22.88 7.8,23.71 8.58,23.92 | 8.58,23.92 D6.1 | X6.P$2 8.13,25.75 8.58,23.92
N$19
  Top 0.152: R17.2 9.14,22.55 Q6.1 9.19,19.5 8.94,19.14 7.9,18.84 7.49,18.97 R18.2
N$20  (via drill 0.35)
  Top 0.152: R13.2 14.5,26.81 14.4,26.94 X5.P$1
  Top 0.406: D5.3 14.68,29.43 X5.P$1 | v18.64,32.71 v24.94,26.41
  Bottom 0.406: U5.3 23.29,25.24 C9.2 v24.94,26.41 | X5.P$1 v18.64,32.71
N$21
  Top 0.152: LED6.A 3.99,23.23 R16.1
N$24  (via drill 0.35)
  Top 0.152: R16.2 5.26,22.17 5.18,22.42 X6.P$1
  Top 0.406: D6.3 6.58,24.32 X6.P$1 | v11.68,25.29 v14.07,16.88
  Bottom 0.406: X6.P$1 v11.68,25.29 | U6.3 12.19,16.58 C11.2 v14.07,16.88
N$25
  Top 0.152: R21.2 X10.P$1
N$26
  Top 0.152: LED1.C 5.89,58.87 X1.P$2
  Top 0.406: Q1.3 5.59,63.44 4.7,63.03 4.01,63.27 3.79,63.35 | 3.79,63.35 D1.1 | X1.P$2 3.2,61.74 3.79,63.35
N$28
  Top 0.152: R2.2 Q1.1 5.99,67.2 6.47,67.43 7.49,67.05 7.72,66.64 7.62,66.31 7.77,66.03 R1.2
N$38
  Top 0.152: U7.2 39.98,49.47 39.72,49.7 R82.2
N$41
  Top 0.152: U7.1 39.47,48.63 39.29,48.81 R82.1
PT_DS+
  Top 0.152: U7.5 41.45,46.42 40.94,45.33 40.94,33.47 38.58,31.1 X8.P$3
PT_US+
  Top 0.152: U7.4 40.97,46.4 40.56,45.43 40.56,35.22 38.07,32.73 31.8,32.73 31.7,32.63 X7.P$3
SCL
  Top 0.152: R82.4 39.32,51.4 39.47,51.53 U7.10 39.47,52.9 33.8,61.31 32.26,61.79 28.55,59.48 J2.6 27.3,61.66 27.69,61.92 31.11,64.13 31.49,65.09 21.05,81.35 11.71,81.35 X9.P$3
SDA
  Top 0.152: R82.3 39.72,50.51 39.95,50.74 U7.9 39.95,52.92 34.06,61.66 31.14,62.5 | X9.P$4 13.34,82.82 14.63,81.65 21.26,81.65 32,64.94 31.14,62.5 | 31.14,62.5 J2.5

### Text on the board
tPlace: Project / Cold Steer | Control Board | P+ | Designed by / Shawn Victor | P- | Y+ | Y- | R+ | R-